# EAGLE schematic avr_adc_7seg (EAGLE 7.5.0)
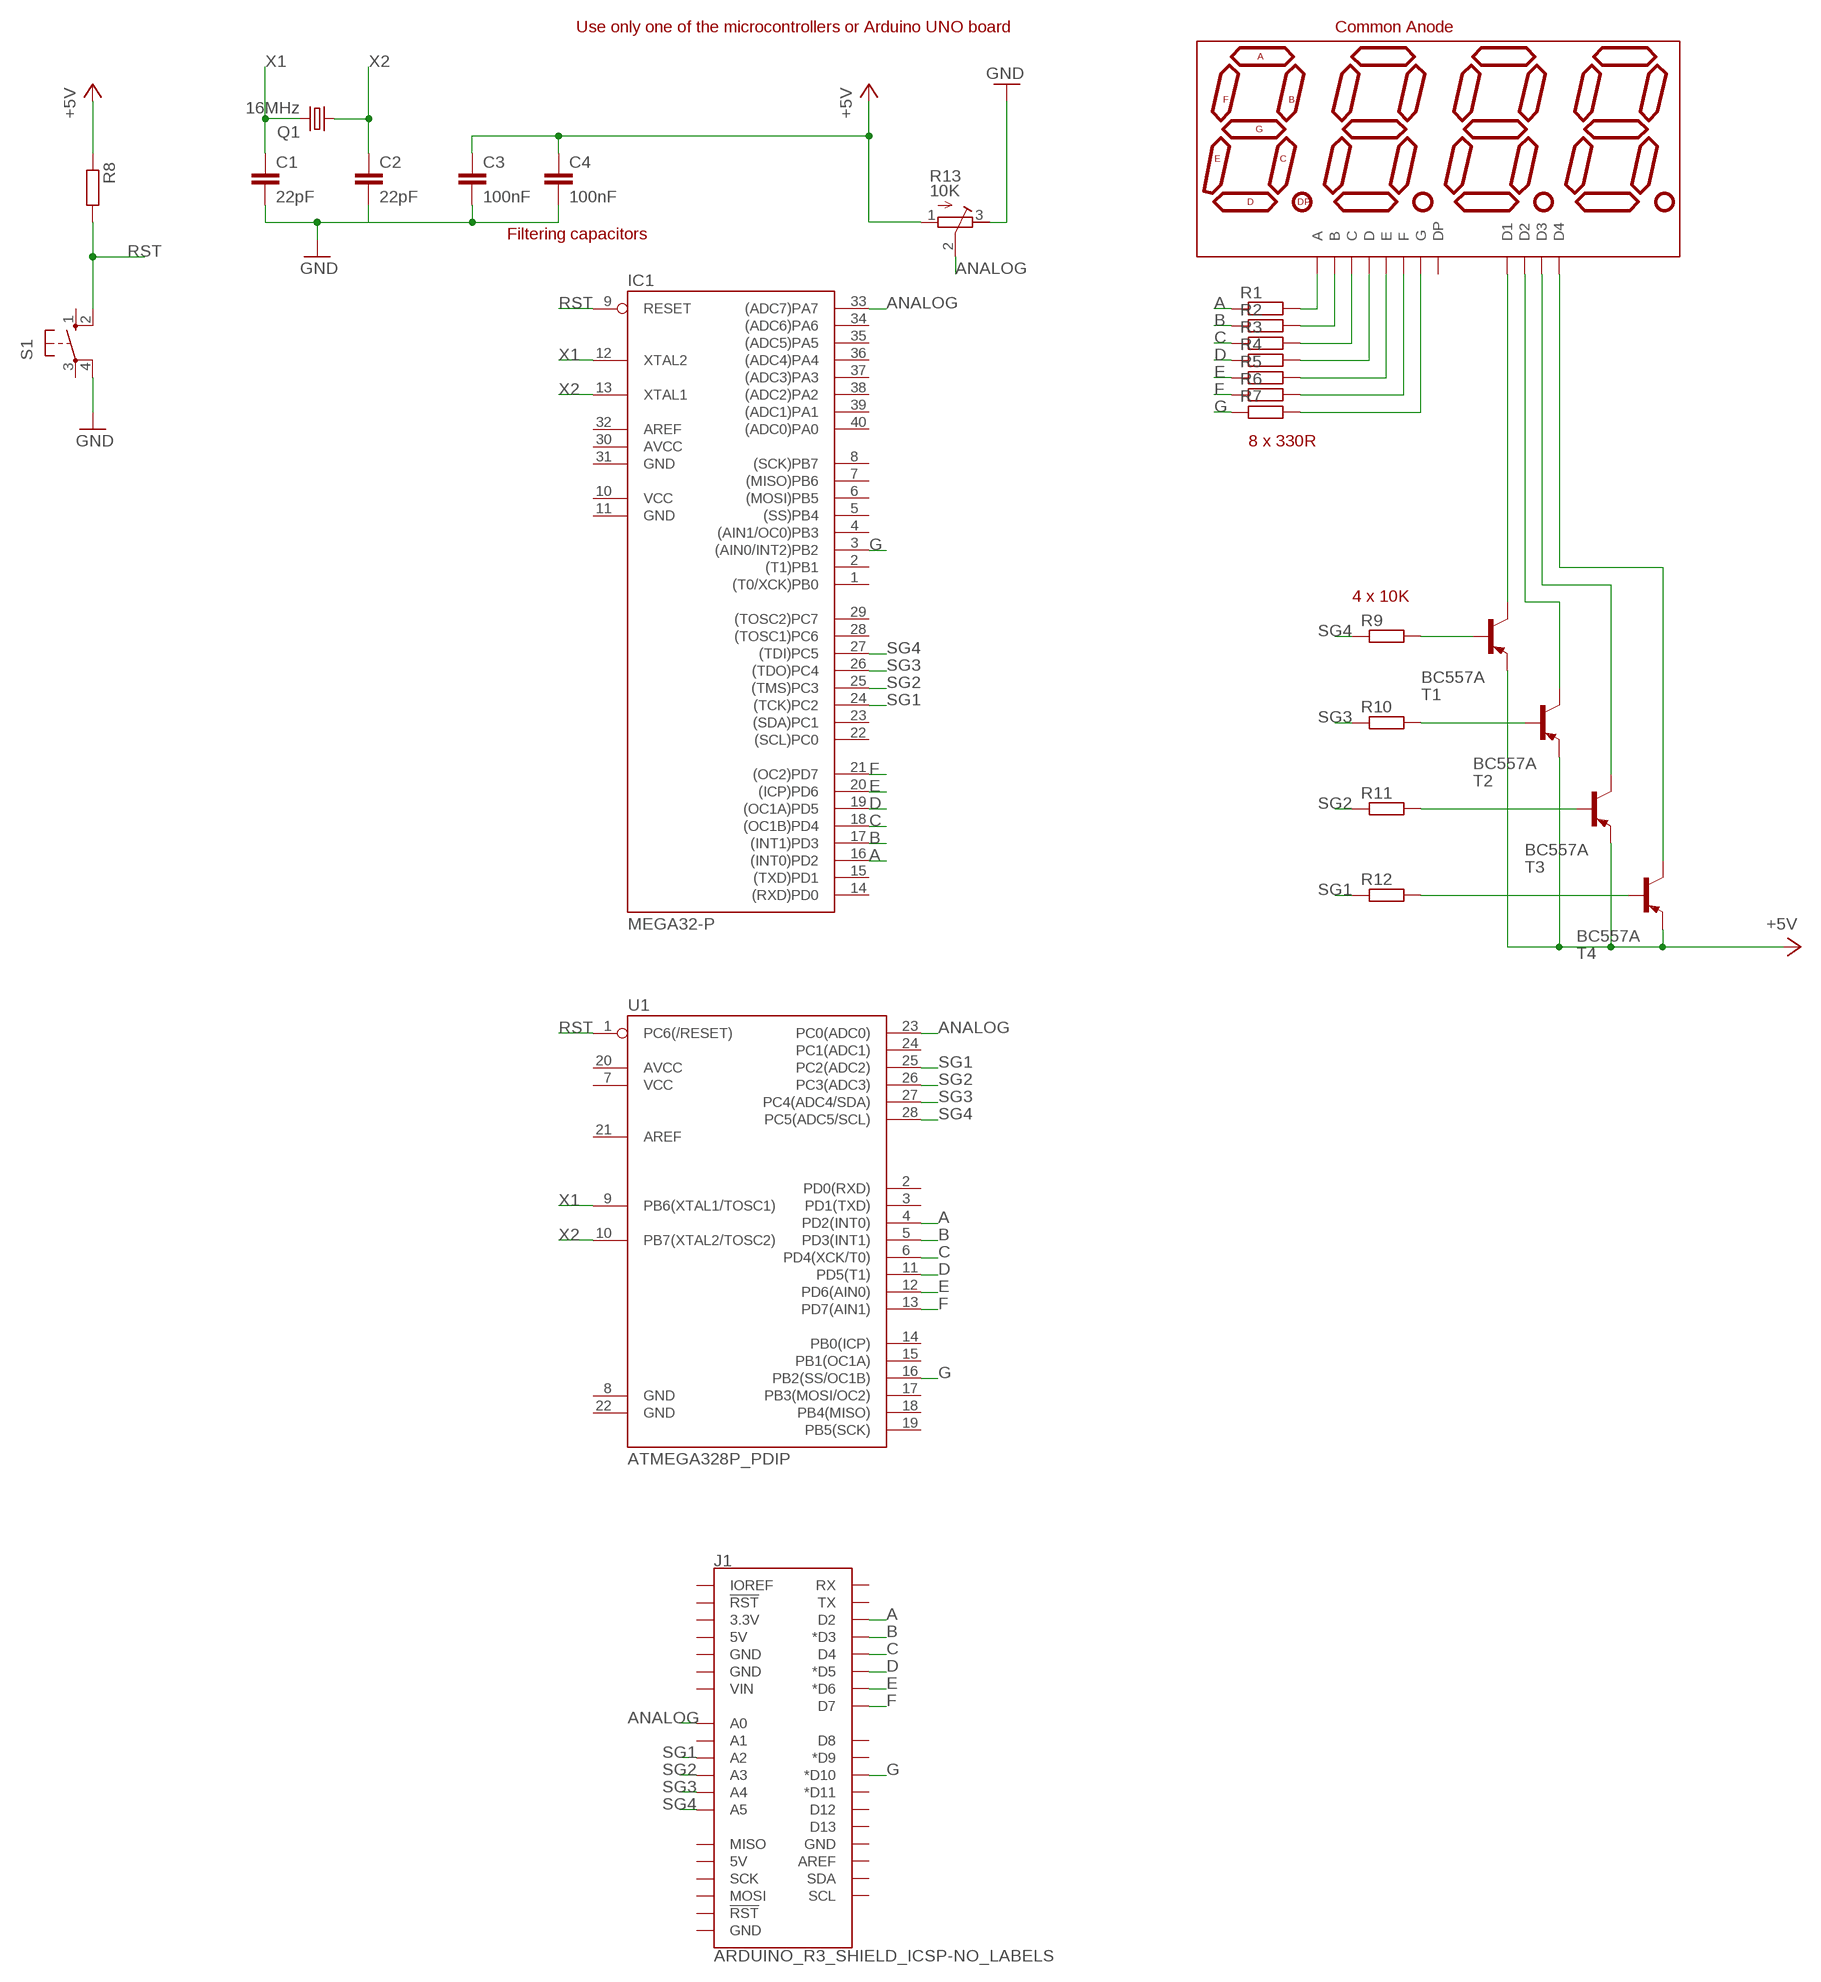
[diagram p0: schematic, sheet 1]

## Parts
C1  22pF  C-EU025-025X050  [C025-025X050]
C2  22pF  C-EU025-025X050  [C025-025X050]
C3  100nF  C-EU025-025X050  [C025-025X050]
C4  100nF  C-EU025-025X050  [C025-025X050]
DISP1  7-SEGMENT-4DIGIT-COUNTERPTH  [7-SEGMENT-4DIGIT-COUNTER]
IC1  MEGA32-P  [DIL40]
J1  ARDUINO_R3_SHIELD_ICSP-NO_LABELS  [UNO_R3_SHIELD_ICSP_NOLABELS]
Q1  16MHz  CRYSTALHC49S  [HC49/S]
R1  R-EU_0207/7  [0207/7]
R2  R-EU_0207/7  [0207/7]
R3  R-EU_0207/7  [0207/7]
R4  R-EU_0207/7  [0207/7]
R5  R-EU_0207/7  [0207/7]
R6  R-EU_0207/7  [0207/7]
R7  R-EU_0207/7  [0207/7]
R8  R-EU_0207/7  [0207/7]
R9  R-EU_0207/7  [0207/7]
R10  R-EU_0207/7  [0207/7]
R11  R-EU_0207/7  [0207/7]
R12  R-EU_0207/7  [0207/7]
R13  10K  R-TRIMM3339P  [RTRIM3339P]
S1  10-XX  [B3F-10XX]
T1  BC557A  BC557A-PNP-TO92-EBC  [TO92-EBC]
T2  BC557A  BC557A-PNP-TO92-EBC  [TO92-EBC]
T3  BC557A  BC557A-PNP-TO92-EBC  [TO92-EBC]
T4  BC557A  BC557A-PNP-TO92-EBC  [TO92-EBC]
U1  ATMEGA328P_PDIP  [DIL28-3]

## Nets
+5V: C3.1 C4.1 R8.1 R13.1(A) T1.E T2.E T3.E T4.E
A: IC1.16((INT0)PD2) J1.D2 R1.1 U1.4(PD2(INT0))
ANALOG: IC1.33((ADC7)PA7) J1.A0 R13.2(S) U1.23(PC0(ADC0))
B: IC1.17((INT1)PD3) J1.D3(*D3) R2.1 U1.5(PD3(INT1))
C: IC1.18((OC1B)PD4) J1.D4 R3.1 U1.6(PD4(XCK/T0))
D: IC1.19((OC1A)PD5) J1.D5(*D5) R4.1 U1.11(PD5(T1))
E: IC1.20((ICP)PD6) J1.D6(*D6) R5.1 U1.12(PD6(AIN0))
F: IC1.21((OC2)PD7) J1.D7 R6.1 U1.13(PD7(AIN1))
G: IC1.3((AIN0/INT2)PB2) J1.D10(*D10) R7.1 U1.16(PB2(SS/OC1B))
GND: C1.2 C2.2 C3.2 C4.2 R13.3(E) S1.4(P1)
N$1: DISP1.11(A) R1.2
N$2: DISP1.7(B) R2.2
N$3: DISP1.4(C) R3.2
N$4: DISP1.2(D) R4.2
N$5: DISP1.1(E) R5.2
N$6: DISP1.10(F) R6.2
N$7: DISP1.5(G) R7.2
N$9: DISP1.12(D1) T1.C
N$10: DISP1.9(D2) T2.C
N$11: DISP1.8(D3) T3.C
N$12: DISP1.6(D4) T4.C
N$14: R12.2 T4.B
N$15: R11.2 T3.B
N$16: R10.2 T2.B
N$17: R9.2 T1.B
RST: IC1.9(RESET) R8.2 S1.2(S1) U1.1(PC6(/RESET))
SG1: IC1.24((TCK)PC2) J1.A2 R12.1 U1.25(PC2(ADC2))
SG2: IC1.25((TMS)PC3) J1.A3 R11.1 U1.26(PC3(ADC3))
SG3: IC1.26((TDO)PC4) J1.A4 R10.1 U1.27(PC4(ADC4/SDA))
SG4: IC1.27((TDI)PC5) J1.A5 R9.1 U1.28(PC5(ADC5/SCL))
X1: C1.1 IC1.12(XTAL2) Q1.2 U1.9(PB6(XTAL1/TOSC1))
X2: C2.1 IC1.13(XTAL1) Q1.1 U1.10(PB7(XTAL2/TOSC2))
Unconnected: DISP1.3(DP) IC1.1((T0/XCK)PB0) IC1.2((T1)PB1) IC1.4((AIN1/OC0)PB3) IC1.5((SS)PB4) IC1.6((MOSI)PB5) IC1.7((MISO)PB6) IC1.8((SCK)PB7) IC1.14((RXD)PD0) IC1.15((TXD)PD1) IC1.22((SCL)PC0) IC1.23((SDA)PC1) IC1.28((TOSC1)PC6) IC1.29((TOSC2)PC7) IC1.32(AREF) IC1.34((ADC6)PA6) IC1.35((ADC5)PA5) IC1.36((ADC4)PA4) IC1.37((ADC3)PA3) IC1.38((ADC2)PA2) IC1.39((ADC1)PA1) IC1.40((ADC0)PA0) J1.3.3V J1.5V J1.5V_ICSP(5V) J1.A1 J1.AREF J1.D8 J1.D9(*D9) J1.D11(*D11) J1.D12 J1.D13 J1.GND@0(GND) J1.GND@1(GND) J1.GND@2(GND) J1.GND_ICSP(GND) J1.IOREF J1.MISO J1.MOSI J1.RES(!RST!) J1.RST_ICSP(!RST!) J1.RX J1.SCK J1.SCL J1.SDA J1.TX J1.VIN S1.1(S) S1.3(P) U1.2(PD0(RXD)) U1.3(PD1(TXD)) U1.7(VCC) U1.8(GND) U1.14(PB0(ICP)) U1.15(PB1(OC1A)) U1.17(PB3(MOSI/OC2)) U1.18(PB4(MISO)) U1.19(PB5(SCK)) U1.20(AVCC) U1.21(AREF) U1.22(GND) U1.24(PC1(ADC1))

## Notes on the sheet
- Use only one of the microcontrollers or Arduino UNO board | Common Anode
- Filtering capacitors
- 8 x 330R
- 4 x 10K

## Power pins joined to a net without a drawn wire
AVCC: IC1.30(AVCC)
GND: IC1.11(GND) IC1.31(GND)
VCC: IC1.10(VCC)

## Library data of the parts
C1-C4 = rcl:C-EU: CAPACITOR, European symbol
DISP1 = SparkFun-Displays:7-SEGMENT-4DIGIT-COUNTER
IC1 = atmel:MEGA32-P: MICROCONTROLLER 32 Kbytes FLASH 2 Kbytes SRAM 1 Kbytes EEPROM USART 8-channel 10 bit ADC Source: www.atmel.com .. doc2503.pdf; MPN: ATMEGA32-16PU; OC_FARNELL: 1661729; OC_NEWARK: 51P1794
J1 = SparkFun-Boards:ARDUINO_R3_SHIELD_ICSP: Arduino R3 Shield Footprint w/ 6-pin (2x3) ICSP Header
Q1 = crystal:CRYSTAL: CRYSTAL; OC_FARNELL: 1667008; OC_NEWARK: unknown
R1-R12 = rcl:R-EU_: RESISTOR, European symbol
R13 = rcl:R-TRIMM: Trimm resistor
S1 = switch-omron:10-XX: OMRON SWITCH; MPN: B3F-1000; OC_FARNELL: 176432; OC_NEWARK: 36M3542
T1-T4 = transistor:*-PNP-: PNP Transistror
U1 = SparkFun-DigitalIC:ATMEGA328P_PDIP: uC used in the Arduino 32kb flash, 1k EEPROM, 2k SRAM This is the through-hole version of this chip.